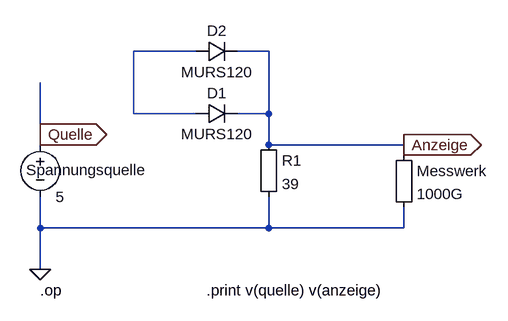
[diagram p0: schematic V2 ODER.asc]
V2 ODER.asc, the LTspice schematic file:
Version 4
SHEET 1 920 680
WIRE 80 32 -16 32
WIRE 192 32 144 32
WIRE -16 128 -16 32
WIRE 80 128 -16 128
WIRE 192 128 192 32
WIRE 192 128 144 128
WIRE -160 160 -160 80
WIRE -160 176 -160 160
WIRE 192 176 192 128
WIRE 400 176 192 176
WIRE 400 192 400 176
WIRE -160 304 -160 256
WIRE 192 304 192 256
WIRE 192 304 -160 304
WIRE 400 304 400 272
WIRE 400 304 192 304
WIRE -160 368 -160 304
FLAG -160 368 0
FLAG -160 160 Quelle
IOPIN -160 160 Out
FLAG 400 176 Anzeige
IOPIN 400 176 Out
SYMBOL voltage -160 160 R0
WINDOW 0 -22 55 Left 2
SYMATTR InstName Spannungsquelle
SYMATTR Value 5
SYMBOL Misc\\EuropeanResistor 384 176 R0
SYMATTR InstName Messwerk
SYMATTR Value 1000G
SYMBOL Misc\\EuropeanResistor 176 160 R0
SYMATTR InstName R1
SYMATTR Value 39
SYMBOL diode 80 144 R270
WINDOW 0 32 32 VTop 2
WINDOW 3 0 32 VBottom 2
SYMATTR InstName D1
SYMATTR Value MURS120
SYMBOL diode 80 48 R270
WINDOW 0 32 32 VTop 2
WINDOW 3 0 32 VBottom 2
SYMATTR InstName D2
SYMATTR Value MURS120
TEXT -160 400 Left 2 !.op
TEXT 96 400 Left 2 !.print v(quelle) v(anzeige)

The netlist it stands for:
* V2 ODER.asc
V§Spannungsquelle Quelle 0 5
R§Messwerk Anzeige 0 1000G
R1 Anzeige 0 39
D1 N001 Anzeige MURS120
D2 N001 Anzeige MURS120
.model D D
.lib standard.dio
.op
.print v(quelle) v(anzeige)
.backanno
.end